# Altium schematic sheet 24V_FETS.SchDoc
size A4; SheetNumber: 12; SheetTotal: 14
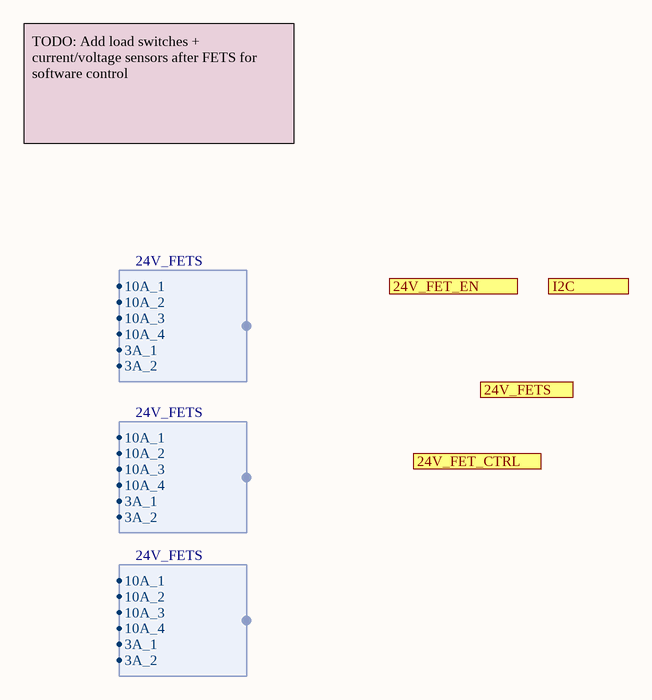
[diagram p0: 24V_FETS.SchDoc]

## Ports
24V_FET_CTRL (harness 24V_FETS), 24V_FET_EN (harness 24V_FETS), 24V_FETS (harness 24V_FETS), I2C (harness I2C)

## Harnesses
24V_FETS: 10A_1, 10A_2, 10A_3, 10A_4, 3A_1, 3A_2

## Notes on the sheet
- TODO: Add load switches + current/voltage sensors after FETS for software control